# Altium schematic sheet v1.0.SchDoc
size 106 x 63 mm
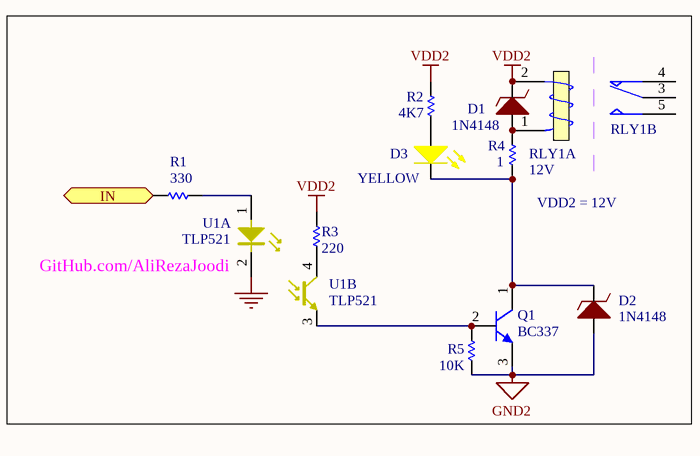
[diagram p0: v1.0.SchDoc]

## Parts
D1  1N4148  [D_THD_AXIAL0.3_DO-35]
D2  1N4148  [D_THD_AXIAL0.3_DO-35]
D3  YELLOW  [LED_THD_3MM_YELLOW_R]
Q1  BC337  [TO92C]
R1  330  [R_THD_AXIAL0.4(1/4W)]
R2  4K7  [R_THD_AXIAL0.4(1/4W)]
R3  220  [R_THD_AXIAL0.4(1/4W)]
R4  1  [R_THD_AXIAL0.4(1/4W)]
R5  10K  [R_THD_AXIAL0.4(1/4W)]
RLY1  12V  [RELAY_SPDT_5PIN_2216]  (parts A,B of 2)
U1  TLP521  [DIP_4]  (parts A,B of 2)

## Ports
IN (in)

## Nets
GND: U1.2(K)
GND2: D2.1 Q1.3(E) R5.2
VDD2: D1.2 R2.2 R3.1 RLY1.2(T1)
IN: R1.2 ; port IN
NetD1_1: D1.1 R4.2 RLY1.1(T2)
NetD2_2: D2.2 D3.2(K) Q1.1(C) R4.1
NetD3_1: D3.1(A) R2.1
NetQ1_2: Q1.2(B) R5.1 U1.3(E)
NetR1_1: R1.1 U1.1(A)
NetR3_2: R3.2 U1.4(C)

Not connected (* = marked no-connect by the designer): RLY1 3(COM) 4(NC) 5(NO)

## Notes on the sheet
- (near R4) VDD2 = 12V
- (near U1) GitHub.com/AliRezaJoodi

## Library data of the parts
D1 D2 = Diode_Zener: Diode, Zener; Revision: July-2002: Re-released for DXP Platform.
D3 = LED_YELLOW: LED, Yellow; Manufacturer: Generic Components; Class I: Optoelectronic; Published: 8-Jun-2000; Revision: July-2002: Re-released for DXP Platform.; Publisher: Altium Limited; Class II: LED
Q1 = NPN: NPN Bipolar Transistor; Manufacturer: Generic Components; Class I: Discrete; Class II: BJT - Low Power; Published: 8-Jun-2000; Revision: July-2002: Re-released for DXP Platform.; Publisher: Altium Limited
R1-R5 = Resistor: Revision: July-2002: Re-released for DXP Platform.
RLY1 = Relay_SPDT_2Form: SPDT Relay
U1 = Optoisolator: Publisher: Altium Limited